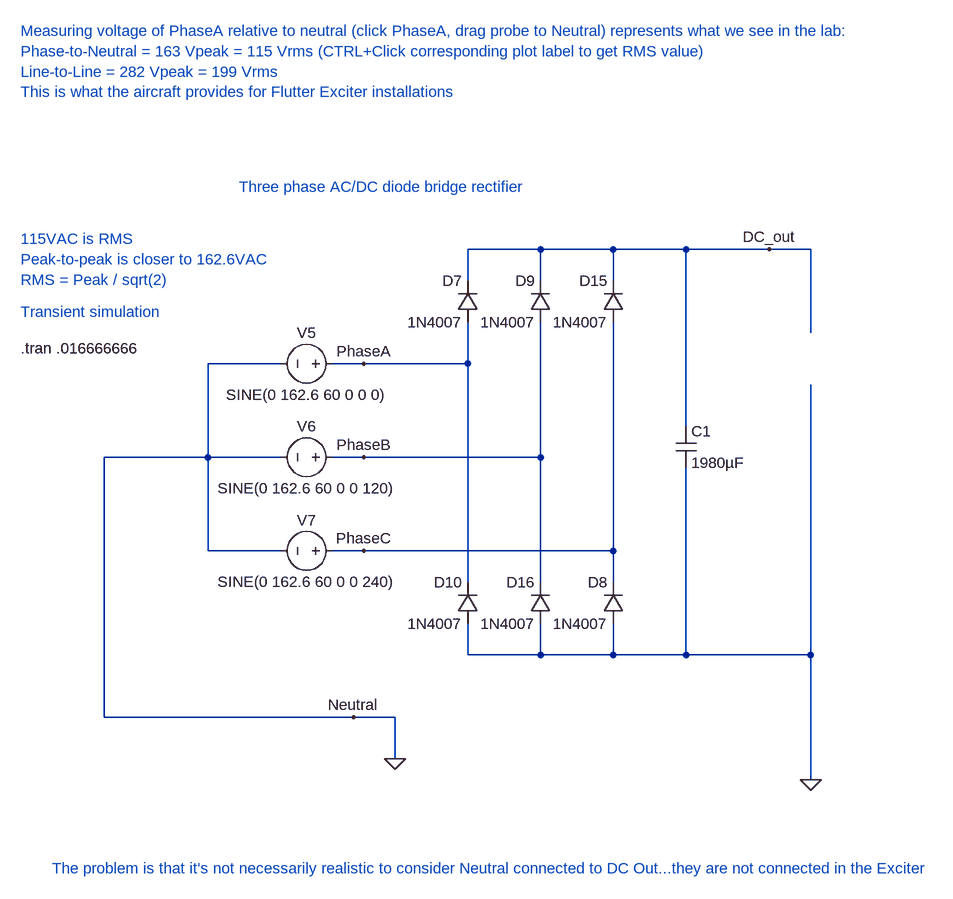
[diagram p0: schematic 2025-09-22 3-Phase Rectifier 3.asc]
2025-09-22 3-Phase Rectifier 3.asc, the LTspice schematic file:
Version 4.1
SHEET 1 3088 1720
WIRE 2368 752 2256 752
WIRE 2480 752 2368 752
WIRE 2592 752 2480 752
WIRE 2720 752 2592 752
WIRE 2784 752 2720 752
WIRE 2256 800 2256 752
WIRE 2368 800 2368 752
WIRE 2480 800 2480 752
WIRE 2784 880 2784 752
WIRE 1968 928 1856 928
WIRE 2096 928 2048 928
WIRE 2256 928 2256 864
WIRE 2256 928 2096 928
WIRE 2592 1024 2592 752
WIRE 1856 1072 1856 928
WIRE 1856 1072 1696 1072
WIRE 1968 1072 1856 1072
WIRE 2096 1072 2048 1072
WIRE 2368 1072 2368 864
WIRE 2368 1072 2096 1072
WIRE 1856 1216 1856 1072
WIRE 1968 1216 1856 1216
WIRE 2096 1216 2048 1216
WIRE 2480 1216 2480 864
WIRE 2480 1216 2096 1216
WIRE 2256 1264 2256 928
WIRE 2368 1264 2368 1072
WIRE 2480 1264 2480 1216
WIRE 2256 1376 2256 1328
WIRE 2368 1376 2368 1328
WIRE 2368 1376 2256 1376
WIRE 2480 1376 2480 1328
WIRE 2480 1376 2368 1376
WIRE 2592 1376 2592 1088
WIRE 2592 1376 2480 1376
WIRE 2784 1376 2784 960
WIRE 2784 1376 2592 1376
WIRE 1696 1472 1696 1072
WIRE 2080 1472 1696 1472
WIRE 2144 1472 2080 1472
WIRE 2144 1536 2144 1472
WIRE 2784 1568 2784 1376
FLAG 2720 752 DC_out
FLAG 2784 1568 0
FLAG 2080 1472 Neutral
FLAG 2096 928 PhaseA
FLAG 2096 1072 PhaseB
FLAG 2096 1216 PhaseC
FLAG 2144 1536 0
SYMBOL voltage 2064 928 R90
WINDOW 0 -32 56 VBottom 2
WINDOW 3 32 56 VTop 2
WINDOW 123 0 0 Left 0
WINDOW 39 0 0 Left 0
SYMATTR InstName V5
SYMATTR Value SINE(0 162.6 60 0 0 0)
SYMBOL voltage 2064 1072 R90
WINDOW 0 -32 56 VBottom 2
WINDOW 3 32 56 VTop 2
WINDOW 123 0 0 Left 0
WINDOW 39 0 0 Left 0
SYMATTR InstName V6
SYMATTR Value SINE(0 162.6 60 0 0 120)
SYMBOL voltage 2064 1216 R90
WINDOW 0 -32 56 VBottom 2
WINDOW 3 32 56 VTop 2
WINDOW 123 0 0 Left 0
WINDOW 39 0 0 Left 0
SYMATTR InstName V7
SYMATTR Value SINE(0 162.6 60 0 0 240)
SYMBOL diode 2272 864 R180
WINDOW 0 24 64 Left 2
WINDOW 3 24 0 Left 2
SYMATTR InstName D7
SYMATTR Value 1N4007
SYMBOL diode 2496 1328 R180
WINDOW 0 24 64 Left 2
WINDOW 3 24 0 Left 2
SYMATTR InstName D8
SYMATTR Value 1N4007
SYMBOL diode 2384 864 R180
WINDOW 0 24 64 Left 2
WINDOW 3 24 0 Left 2
SYMATTR InstName D9
SYMATTR Value 1N4007
SYMBOL diode 2272 1328 R180
WINDOW 0 24 64 Left 2
WINDOW 3 24 0 Left 2
SYMATTR InstName D10
SYMATTR Value 1N4007
SYMBOL diode 2496 864 R180
WINDOW 0 24 64 Left 2
WINDOW 3 24 0 Left 2
SYMATTR InstName D15
SYMATTR Value 1N4007
SYMBOL diode 2384 1328 R180
WINDOW 0 24 64 Left 2
WINDOW 3 24 0 Left 2
SYMATTR InstName D16
SYMATTR Value 1N4007
SYMBOL cap 2576 1024 R0
SYMATTR InstName C1
SYMATTR Value 1980µF
TEXT 1568 904 Left 2 !.tran .016666666
TEXT 1904 656 Left 2 ;Three phase AC/DC diode bridge rectifier
TEXT 1568 848 Left 2 ;Transient simulation
TEXT 1568 736 Left 2 ;115VAC is RMS\nPeak-to-peak is closer to 162.6VAC\nRMS = Peak / sqrt(2)
TEXT 1568 416 Left 2 ;Measuring voltage of PhaseA relative to neutral (click PhaseA, drag probe to Neutral) represents what we see in the lab:\nPhase-to-Neutral = 163 Vpeak = 115 Vrms (CTRL+Click corresponding plot label to get RMS value)\nLine-to-Line = 282 Vpeak = 199 Vrms\nThis is what the aircraft provides for Flutter Exciter installations
TEXT 1616 1704 Left 2 ;The problem is that it's not necessarily realistic to consider Neutral connected to DC Out...they are not connected in the Exciter

The netlist it stands for:
* 2025-09-22 3-Phase Rectifier 3.asc
V5 PhaseA 0 SINE(0 162.6 60 0 0 0)
V6 PhaseB 0 SINE(0 162.6 60 0 0 120)
V7 PhaseC 0 SINE(0 162.6 60 0 0 240)
D7 PhaseA DC_out 1N4007
D8 0 PhaseC 1N4007
D9 PhaseB DC_out 1N4007
D10 0 PhaseA 1N4007
D15 PhaseC DC_out 1N4007
D16 0 PhaseB 1N4007
C1 DC_out 0 1980µF
.model D D
.lib standard.dio
.tran .016666666
* Three phase AC/DC diode bridge rectifier
* Transient simulation
* 115VAC is RMS
* Peak-to-peak is closer to 162.6VAC
* RMS = Peak / sqrt(2)
* Measuring voltage of PhaseA relative to neutral (click PhaseA, drag probe to Neutral) represents what we see in the lab:
* Phase-to-Neutral = 163 Vpeak = 115 Vrms (CTRL+Click corresponding plot label to get RMS value)
* Line-to-Line = 282 Vpeak = 199 Vrms
* This is what the aircraft provides for Flutter Exciter installations
* The problem is that it's not necessarily realistic to consider Neutral connected to DC Out...they are not connected in the Exciter
.backanno
.end